# EAGLE design driver3 (EAGLE 9.5.2)
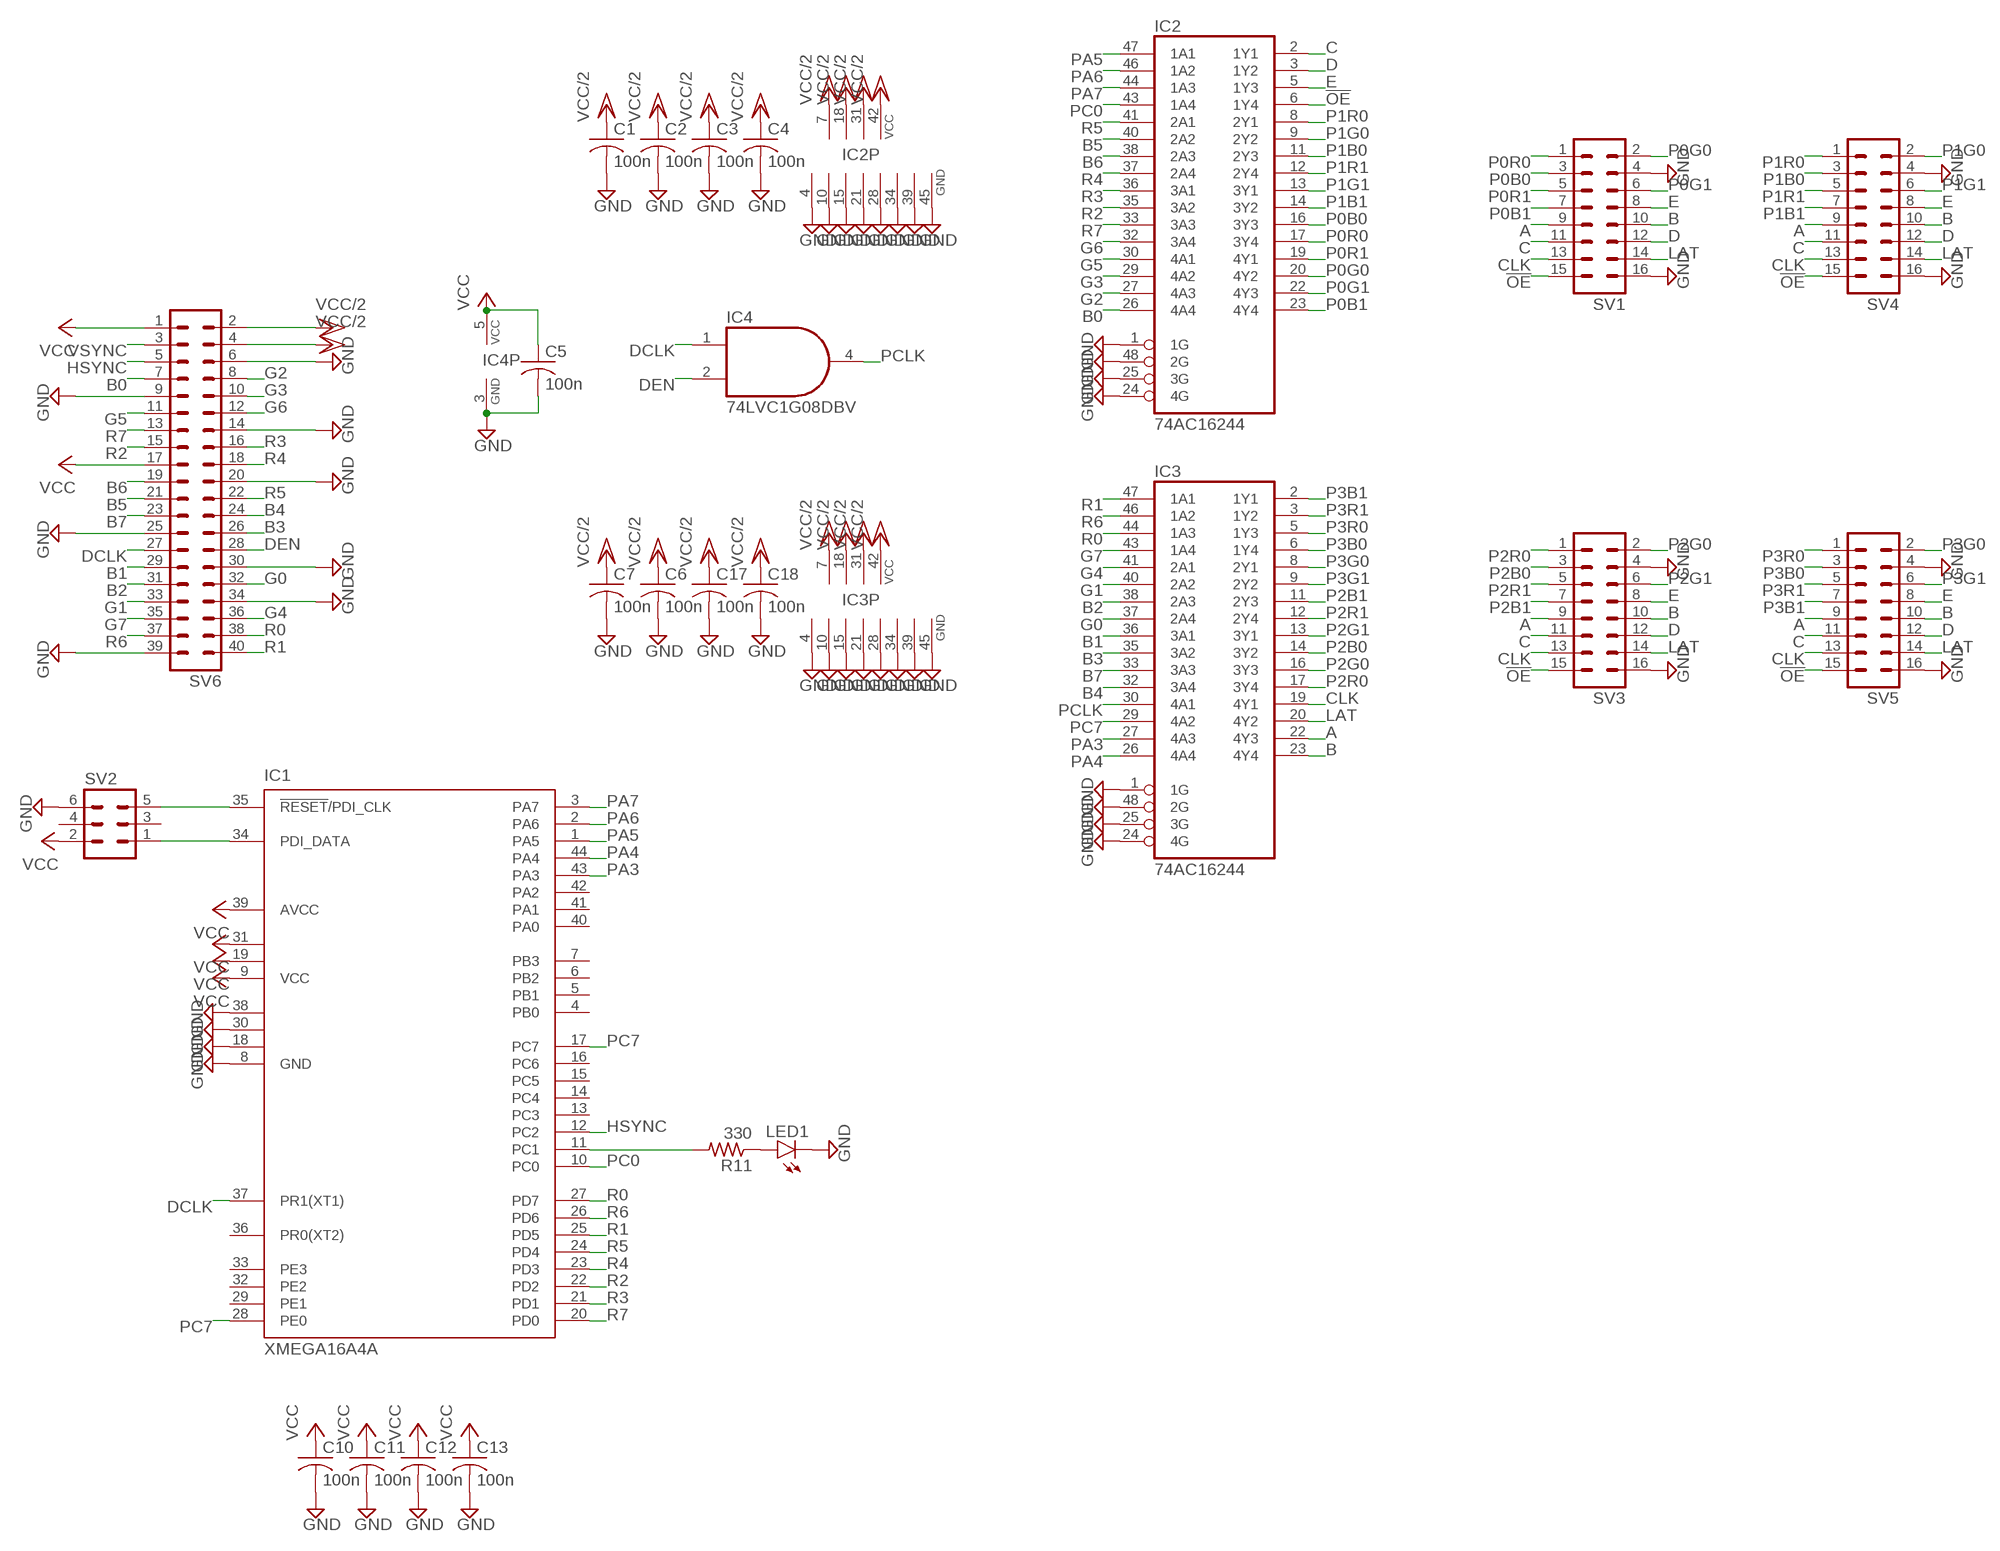
[diagram p0: schematic, sheet 1]

## Parts
C1  100n  C-USC0402  [C0402]
C2  100n  C-USC0402  [C0402]
C3  100n  C-USC0402  [C0402]
C4  100n  C-USC0402  [C0402]
C5  100n  C-USC0402  [C0402]
C6  100n  C-USC0402  [C0402]
C7  100n  C-USC0402  [C0402]
C10  100n  C-USC0402  [C0402]
C11  100n  C-USC0402  [C0402]
C12  100n  C-USC0402  [C0402]
C13  100n  C-USC0402  [C0402]
C17  100n  C-USC0402  [C0402]
C18  100n  C-USC0402  [C0402]
IC1  XMEGA16A4A  [TQFP44]
IC2  74AC16244  [SSOP48DL]
IC3  74AC16244  [SSOP48DL]
IC4  74LVC1G08DBV  [SOT23-5]
LED1  LEDCHIPLED_0805  [CHIPLED_0805]
R11  330  R-US_R0402  [R0402]
SV1  MA08-2  [MA08-2]
SV2  MA03-2  [MA03-2]
SV3  MA08-2  [MA08-2]
SV4  MA08-2  [MA08-2]
SV5  MA08-2  [MA08-2]
SV6  MA20-2  [MA20-2]

## Nets
!OE: IC2.6(1Y4) SV1.15 SV3.15 SV4.15 SV5.15
A: IC3.22(4Y3) SV1.9 SV3.9 SV4.9 SV5.9
B: IC3.23(4Y4) SV1.10 SV3.10 SV4.10 SV5.10
B0: IC2.26(4A4) SV6.7
B1: IC3.36(3A1) SV6.29
B2: IC3.38(2A3) SV6.31
B3: IC3.35(3A2) SV6.26
B4: IC3.32(3A4) SV6.24
B5: IC2.40(2A2) SV6.21
B6: IC2.38(2A3) SV6.19
B7: IC3.33(3A3) SV6.23
C: IC2.2(1Y1) SV1.11 SV3.11 SV4.11 SV5.11
CLK: IC3.19(4Y1) SV1.13 SV3.13 SV4.13 SV5.13
D: IC2.3(1Y2) SV1.12 SV3.12 SV4.12 SV5.12
DCLK: IC1.37(PR1(XT1)) IC4.1(I0) SV6.27
DEN: IC4.2(I1) SV6.28
E: IC2.5(1Y3) SV1.8 SV3.8 SV4.8 SV5.8
G0: IC3.37(2A4) SV6.32
G1: IC3.40(2A2) SV6.33
G2: IC2.27(4A3) SV6.8
G3: IC2.29(4A2) SV6.10
G4: IC3.41(2A1) SV6.36
G5: IC2.30(4A1) SV6.11
G6: IC2.32(3A4) SV6.12
G7: IC3.43(1A4) SV6.35
GND: C1.2 C2.2 C3.2 C4.2 C5.2 C6.2 C7.2 C10.2 C11.2 C12.2 C13.2 C17.2 C18.2 IC1.8(GND) IC1.18(GND1) IC1.30(GND2) IC1.38(GND3) IC2.1(1G) IC2.4(GND) IC2.10(GND) IC2.15(GND) IC2.21(GND) IC2.24(4G) IC2.25(3G) IC2.28(GND) IC2.34(GND) IC2.39(GND) IC2.45(GND) IC2.48(2G) IC3.1(1G) IC3.4(GND) IC3.10(GND) IC3.15(GND) IC3.21(GND) IC3.24(4G) IC3.25(3G) IC3.28(GND) IC3.34(GND) IC3.39(GND) IC3.45(GND) IC3.48(2G) IC4.3(GND) LED1.C SV1.4 SV1.16 SV2.6 SV3.4 SV3.16 SV4.4 SV4.16 SV5.4 SV5.16 SV6.6 SV6.9 SV6.14 SV6.20 SV6.25 SV6.30 SV6.34 SV6.39
HSYNC: IC1.12(PC2) SV6.5
LAT: IC3.20(4Y2) SV1.14 SV3.14 SV4.14 SV5.14
N$1: IC1.11(PC1) R11.2
N$41: IC1.34(PDI_DATA) SV2.1
N$42: IC1.35(!RESET!/PDI_CLK) SV2.5
N$45: LED1.A R11.1
P0B0: IC2.16(3Y3) SV1.3
P0B1: IC2.23(4Y4) SV1.7
P0G0: IC2.20(4Y2) SV1.2
P0G1: IC2.22(4Y3) SV1.6
P0R0: IC2.17(3Y4) SV1.1
P0R1: IC2.19(4Y1) SV1.5
P1B0: IC2.11(2Y3) SV4.3
P1B1: IC2.14(3Y2) SV4.7
P1G0: IC2.9(2Y2) SV4.2
P1G1: IC2.13(3Y1) SV4.6
P1R0: IC2.8(2Y1) SV4.1
P1R1: IC2.12(2Y4) SV4.5
P2B0: IC3.14(3Y2) SV3.3
P2B1: IC3.11(2Y3) SV3.7
P2G0: IC3.16(3Y3) SV3.2
P2G1: IC3.13(3Y1) SV3.6
P2R0: IC3.17(3Y4) SV3.1
P2R1: IC3.12(2Y4) SV3.5
P3B0: IC3.6(1Y4) SV5.3
P3B1: IC3.2(1Y1) SV5.7
P3G0: IC3.8(2Y1) SV5.2
P3G1: IC3.9(2Y2) SV5.6
P3R0: IC3.5(1Y3) SV5.1
P3R1: IC3.3(1Y2) SV5.5
PA3: IC1.43(PA3) IC3.27(4A3)
PA4: IC1.44(PA4) IC3.26(4A4)
PA5: IC1.1(PA5) IC2.47(1A1)
PA6: IC1.2(PA6) IC2.46(1A2)
PA7: IC1.3(PA7) IC2.44(1A3)
PC0: IC1.10(PC0) IC2.43(1A4)
PC7: IC1.17(PC7) IC1.28(PE0) IC3.29(4A2)
PCLK: IC3.30(4A1) IC4.4(O)
R0: IC1.27(PD7) IC3.44(1A3) SV6.38
R1: IC1.25(PD5) IC3.47(1A1) SV6.40
R2: IC1.22(PD2) IC2.35(3A2) SV6.15
R3: IC1.21(PD1) IC2.36(3A1) SV6.16
R4: IC1.23(PD3) IC2.37(2A4) SV6.18
R5: IC1.24(PD4) IC2.41(2A1) SV6.22
R6: IC1.26(PD6) IC3.46(1A2) SV6.37
R7: IC1.20(PD0) IC2.33(3A3) SV6.13
VCC: C5.1 C10.1 C11.1 C12.1 C13.1 IC1.9(VCC) IC1.19(VCC1) IC1.31(VCC2) IC1.39(AVCC) IC4.5(VCC) SV2.2 SV6.1 SV6.17
VCC/2: C1.1 C2.1 C3.1 C4.1 C6.1 C7.1 C17.1 C18.1 IC2.7(VCC) IC2.18(VCC) IC2.31(VCC) IC2.42(VCC) IC3.7(VCC) IC3.18(VCC) IC3.31(VCC) IC3.42(VCC) SV6.2 SV6.4
VSYNC: SV6.3
Unconnected: IC1.4(PB0) IC1.5(PB1) IC1.6(PB2) IC1.7(PB3) IC1.13(PC3) IC1.14(PC4) IC1.15(PC5) IC1.16(PC6) IC1.29(PE1) IC1.32(PE2) IC1.33(PE3) IC1.36(PR0(XT2)) IC1.40(PA0) IC1.41(PA1) IC1.42(PA2) SV2.3 SV2.4

## Library data of the parts
C1-C7 C10-C13 C17 C18 = rcl:C-US: CAPACITOR, American symbol; SPICEPREFIX: C
IC1 = atmel:XMEGA16A4: MICROCONTROLLER Features High-performance, Low-power 8/16-bit AVR XMEGA Microcontroller Non-Volatile Program and Data Memories - 16 KB - 128 KB of In-System Self-Programmable Flash - 4 KB - 8 KB Boot Code Section with Independent Lock Bits - 1 KB - 2 KB EEPROM - 2 KB - 8 KB Internal SRAM Peripheral Features - Four-channel DMA Controller with support for external requests - Eight-channel Event System - Five 16-bit Timer/Counters Three Timer/Counters with 4 Output Compare or Input Capture channels Two Timer/Counters with 2 Output Compare or Input Capture channels High-Resolution Extensions on all Timer/Counters Advanced Waveform Extension on one Timer/Counter - Five USARTs IrDA Extension on one USART - Two Two-Wire Interfaces with dual address match (I2C and SMBus compatible) - Two SPIs (Serial Peripheral Interfaces) peripherals - AES and DES Crypto Engine - 16-bit Real Time Counter with Separate Oscillator - One Twelve-channel, 12-bit, 2 Msps Analog to Digital Converter - One Two-channel, 12-bit, 1 Msps Digital to Analog Converter - Two Analog Comparators with Window compare function - External Interrupts on all General Purpose I/O pins - Programmable Watchdog Timer with Separate On-chip Ultra Low Power Oscillator Special Microcontroller Features - Power-on Reset and Programmable Brown-out Detection - Internal and External Clock Options with PLL - Programmable Multi-level Interrupt Controller - Sleep Modes: Idle, Power-down, Standby, Power-save, Extended Standby - Advanced Programming, Test and Debugging Interfaces PDI (Program and Debug Interface) for programming, test and debugging I/O and Packages - 34 Programmable I/O Lines - 44 - lead TQFP - 44 - pad VQFN/QFN - 49 - ball VFBGA Operating Voltage - 1.6 - 3.6V Speed performance - 0 - 12 MHz @ 1.6 - 3.6V - 0 - 32 MHz @ 2.7 - 3.6V Drawn by Dipl.-Ing. (FH) Robert Siegler Created: 27.05.09; OC_FARNELL: unknown; OC_NEWARK: unknown
IC2 IC3 = 74ac-logic:74AC16244: 16-bit BUFFER/LINE DRIVER, 3-state
IC4 = 74xx-little-us:74*1G08: 2-input AND gate
LED1 = led:LED: LED OSRAM: - CHIPLED LG R971, LG N971, LY N971, LG Q971, LY Q971, LO R971, LY R971 LH N974, LH R974 LS Q976, LO Q976, LY Q976 LO Q996 - Hyper CHIPLED LW Q18S LB Q993, LB Q99A, LB R99A - SideLED LS A670, LO A670, LY A670, LG A670, LP A670 LB A673, LV A673, LT A673, LW A673 LH A674 LY A675 LS A676, LA A676, LO A676, LY A676, LW A676 LS A679, LY A679, LG A679 - Hyper Micro SIDELED® LS Y876, LA Y876, LO Y876, LY Y876 LT Y87S - SmartLED LW L88C, LW L88S LB L89C, LB L89S, LG L890 LS L89K, LO L89K, LY L89K LS L896, LA L896, LO L896, LY L896 - TOPLED LS T670, LO T670, LY T670, LG T670, LP T670 LSG T670, LSP T670, LSY T670, LOP T670, LYG T670 LG T671, LOG T671, LSG T671 LB T673, LV T673, LT T673, LW T673 LH T674 LS T676, LA T676, LO T676, LY T676, LB T676, LH T676, LSB T676, LW T676 LB T67C, LV T67C, LT T67C, LS T67K, LO T67K, LY T67K, LW E67C LS E67B, LA E67B, LO E67B, LY E67B, LB E67C, LV E67C, LT E67C LW T67C LS T679, LY T679, LG T679 LS T770, LO T770, LY T770, LG T770, LP T770 LB T773, LV T773, LT T773, LW T773 LH T774 LS E675, LA E675, LY E675, LS T675 LS T776, LA T776, LO T776, LY T776, LB T776 LHGB T686 LT T68C, LB T68C - Hyper Mini TOPLED® LB M676 - Mini TOPLED Santana® LG M470 LS M47K, LO M47K, LY M47K Source: http://www.osram.convergy.de LUXEON: - LUMILED® LXK2-PW12-R00, LXK2-PW12-S00, LXK2-PW14-U00, LXK2-PW14-V00 LXK2-PM12-R00, LXK2-PM12-S00, LXK2-PM14-U00 LXK2-PE12-Q00, LXK2-PE12-R00, LXK2-PE12-S00, LXK2-PE14-T00, LXK2-PE14-U00 LXK2-PB12-K00, LXK2-PB12-L00, LXK2-PB12-M00, LXK2-PB14-N00, LXK2-PB14-P00, LXK2-PB14-Q00 LXK2-PR12-L00, LXK2-PR12-M00, LXK2-PR14-Q00, LXK2-PR14-R00 LXK2-PD12-Q00, LXK2-PD12-R00, LXK2-PD12-S00 LXK2-PH12-R00, LXK2-PH12-S00 LXK2-PL12-P00, LXK2-PL12-Q00, LXK2-PL12-R00 Source: www.luxeon.com KINGBRIGHT: KA-3528ASYC Source: www.kingbright.com
R11 = rcl:R-US_: RESISTOR, American symbol; SPICEPREFIX: R
SV1 SV3-SV5 = con-lstb:MA08-2: PIN HEADER; OC_FARNELL: unknown; OC_NEWARK: unknown
SV2 = con-lstb:MA03-2: PIN HEADER; OC_FARNELL: unknown; OC_NEWARK: unknown
SV6 = con-lstb:MA20-2: PIN HEADER; OC_FARNELL: unknown; OC_NEWARK: unknown

## Board
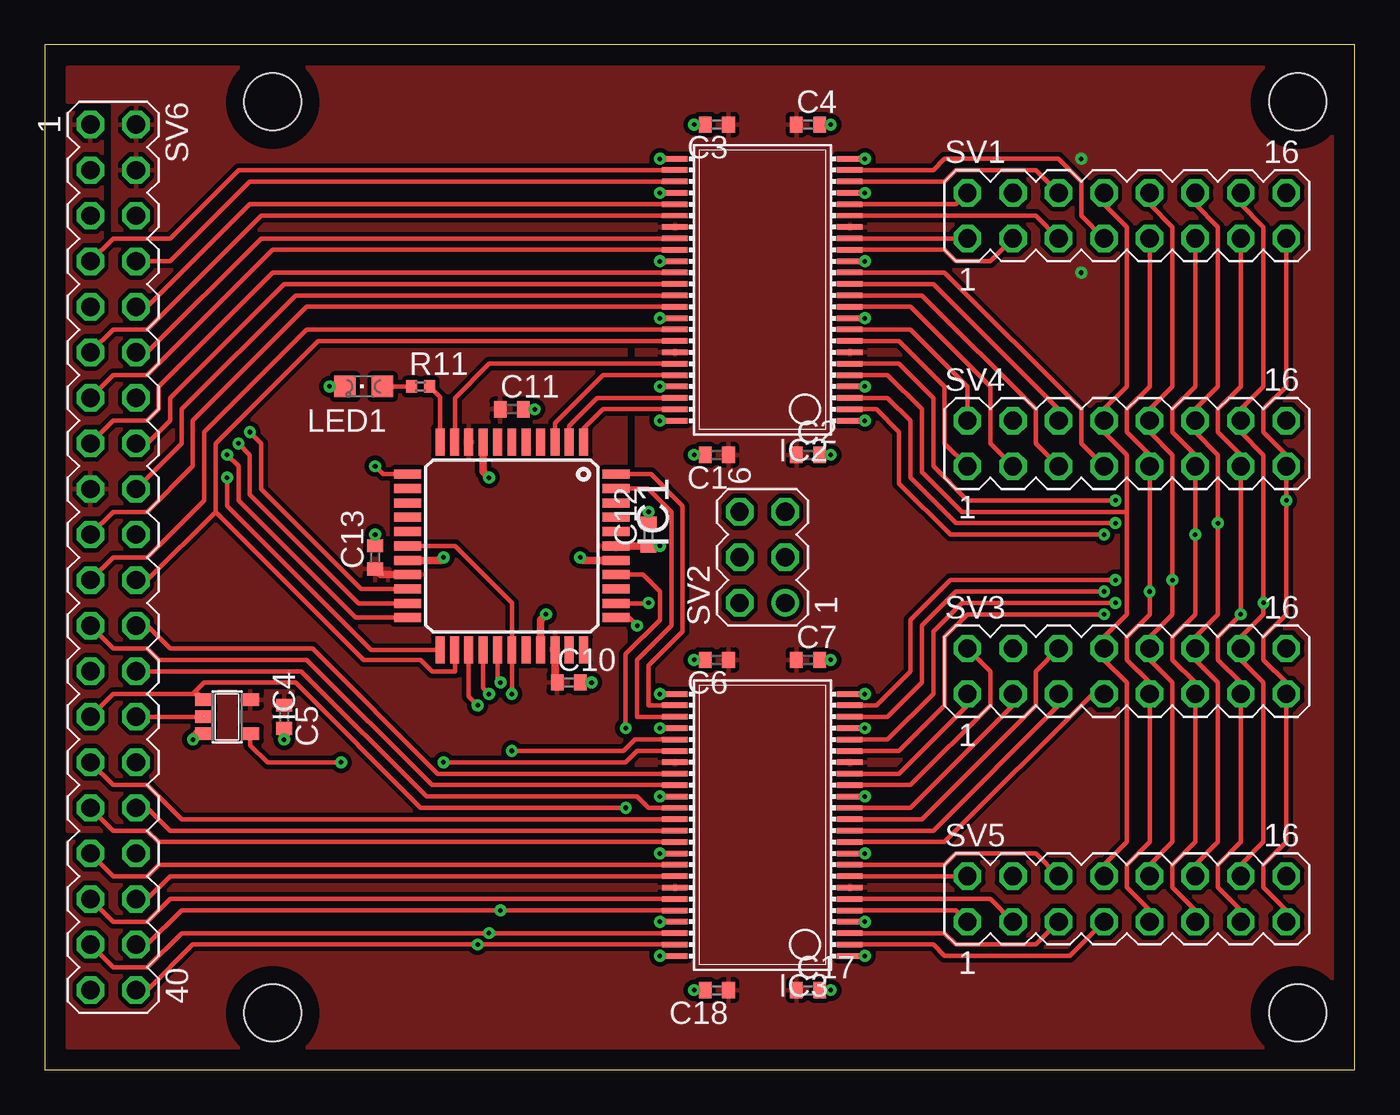
[diagram p1: board, top side]
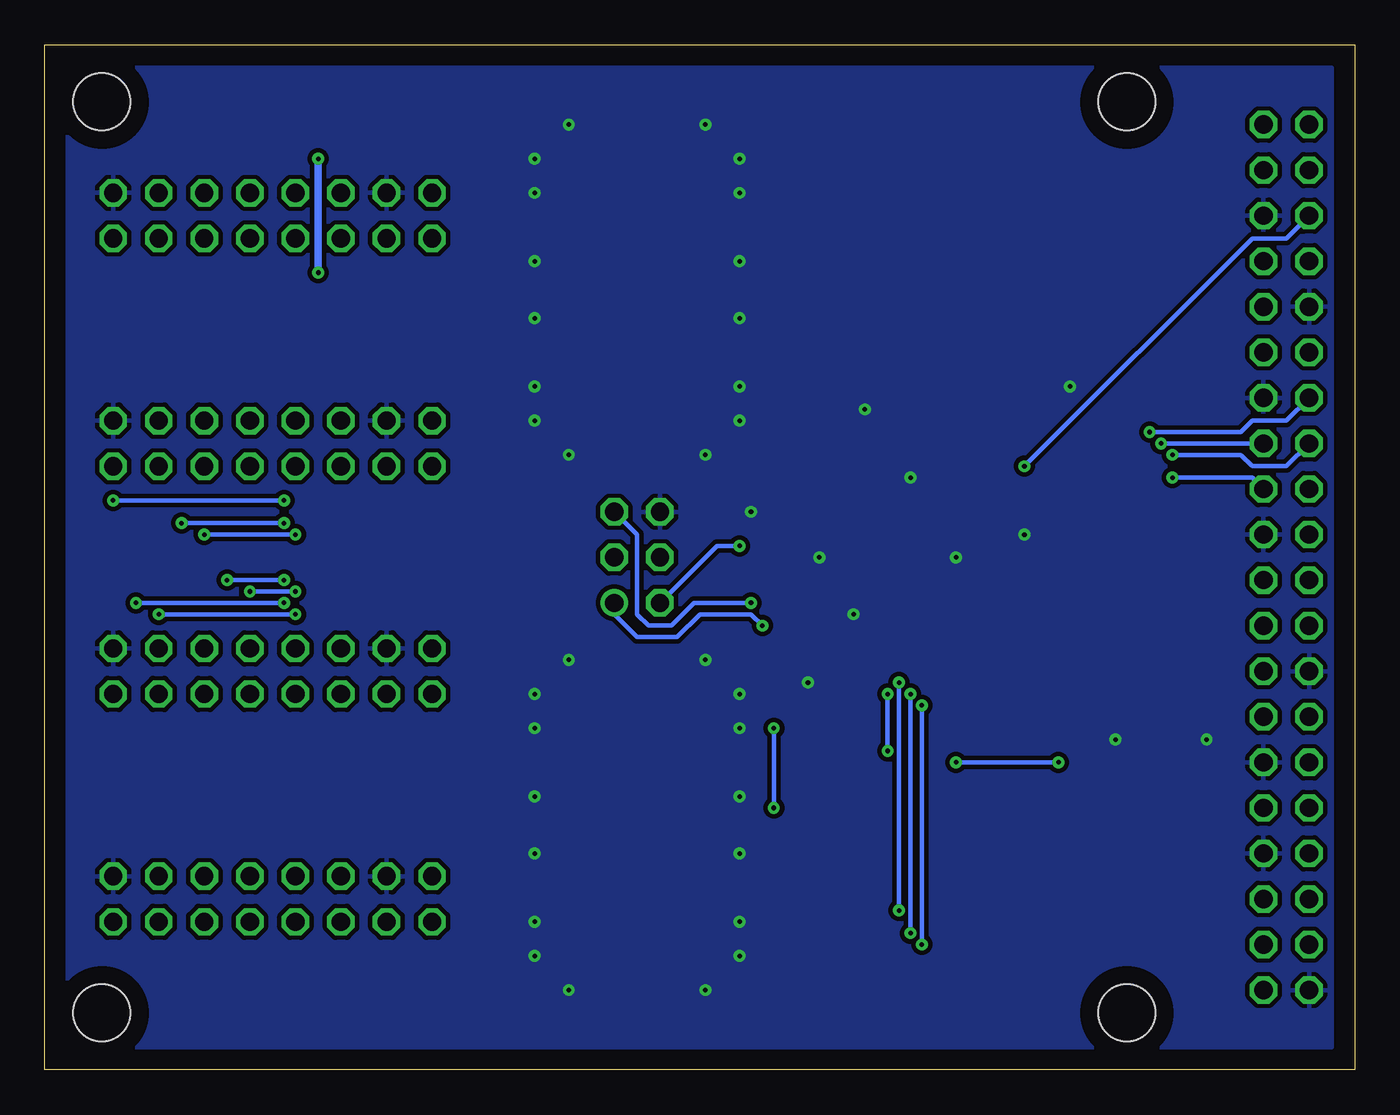
[diagram p2: board, bottom side, seen from below]

Size 73.03 x 57.15 mm. Coordinates in mm from the lower left corner, seen from the top.
Outline: 0,57.15 0,0 73.03,0 73.03,57.15 0,57.15
Copper layers (1*16): Top 0.035mm / dielectric 0.5mm / Bottom 0.035mm
Design rules "33each": minimum track width 5mil, minimum drill 10mil, track to track 5mil, track to pad 5mil, pad to pad 5mil, via to via 5mil, smd to smd 5mil, copper to edge 40mil, drill to drill 8mil, minimum pad ring 10mil, minimum via ring 8mil, stop-mask expansion 4mil, vias tented up to drill 0mil, thermal gap 10mil
Holes 3.17 mm at 12.7,3.17 12.7,53.98 69.85,53.98 69.85,3.17

### Footprints (pad centres in the part's own frame; a part is rotated, then mirrored left to right if it is on the bottom)
C0402 = smd 0.7 x 0.9: 1 -0.65,0; 2 0.65,0
TQFP44 = smd 1.5 x 0.5: 1 -5.8,4; 2 -5.8,3.2; 3 -5.8,2.4; 4 -5.8,1.6; 5 -5.8,0.8; 6 -5.8,0; 7 -5.8,-0.8; 8 -5.8,-1.6; 9 -5.8,-2.4; 10 -5.8,-3.2; 11 -5.8,-4; 23 5.8,-4; 24 5.8,-3.2; 25 5.8,-2.4; 26 5.8,-1.6; 27 5.8,-0.8; 28 5.8,0; 29 5.8,0.8; 30 5.8,1.6; 31 5.8,2.4; 32 5.8,3.2; 33 5.8,4 | smd 0.5 x 1.5: 12 -4,-5.8; 13 -3.2,-5.8; 14 -2.4,-5.8; 15 -1.6,-5.8; 16 -0.8,-5.8; 17 0,-5.8; 18 0.8,-5.8; 19 1.6,-5.8; 20 2.4,-5.8; 21 3.2,-5.8; 22 4,-5.8; 34 4,5.8; 35 3.2,5.8; 36 2.4,5.8; 37 1.6,5.8; 38 0.8,5.8; 39 0,5.8; 40 -0.8,5.8; 41 -1.6,5.8; 42 -2.4,5.8; 43 -3.2,5.8; 44 -4,5.8
SSOP48DL = smd 0.305 x 1.422: 1 -6.985,-4.877; 2 -6.35,-4.877; 3 -5.715,-4.877; 4 -5.08,-4.877; 5 -4.445,-4.877; 6 -3.81,-4.877; 7 -3.175,-4.877; 8 -2.54,-4.877; 9 -1.905,-4.877; 10 -1.27,-4.877; 11 -0.635,-4.877; 12 0,-4.877; 13 0.635,-4.877; 14 1.27,-4.877; 15 1.905,-4.877; 16 2.54,-4.877; 17 3.175,-4.877; 18 3.81,-4.877; 19 4.445,-4.877; 20 5.08,-4.877; 21 5.715,-4.877; 22 6.35,-4.877; 23 6.985,-4.877; 24 7.62,-4.877; 25 7.62,4.877; 26 6.985,4.877; 27 6.35,4.877; 28 5.715,4.877; 29 5.08,4.877; 30 4.445,4.877; 31 3.81,4.877; 32 3.175,4.877; 33 2.54,4.877; 34 1.905,4.877; 35 1.27,4.877; 36 0.635,4.877; 37 0,4.877; 38 -0.635,4.877; 39 -1.27,4.877; 40 -1.905,4.877; 41 -2.54,4.877; 42 -3.175,4.877; 43 -3.81,4.877; 44 -4.445,4.877; 45 -5.08,4.877; 46 -5.715,4.877; 47 -6.35,4.877; 48 -6.985,4.877
SOT23-5 = smd 0.69 x 0.99: 1 -0.95,-1.29; 2 0,-1.29; 3 0.95,-1.29; 4 0.95,1.3; 5 -0.95,1.3
CHIPLED_0805 = smd 1.2 x 1.2: A 0,-1.05; C 0,1.05
R0402 = smd 0.6 x 0.7: 1 -0.5,0; 2 0.5,0
MA08-2 = drill 1.016 octagon: 1 -8.89,-1.27; 2 -8.89,1.27; 3 -6.35,-1.27; 4 -6.35,1.27; 5 -3.81,-1.27; 6 -3.81,1.27; 7 -1.27,-1.27; 8 -1.27,1.27; 9 1.27,-1.27; 10 1.27,1.27; 11 3.81,-1.27; 12 3.81,1.27; 13 6.35,-1.27; 14 6.35,1.27; 15 8.89,-1.27; 16 8.89,1.27
MA03-2 = drill 1.016: 1 -2.54,-1.27 | drill 1.016 octagon: 2 -2.54,1.27; 3 0,-1.27; 4 0,1.27; 5 2.54,-1.27; 6 2.54,1.27
MA20-2 = drill 1.016 octagon: 1 -24.13,-1.27; 2 -24.13,1.27; 3 -21.59,-1.27; 4 -21.59,1.27; 5 -19.05,-1.27; 6 -19.05,1.27; 7 -16.51,-1.27; 8 -16.51,1.27; 9 -13.97,-1.27; 10 -13.97,1.27; 11 -11.43,-1.27; 12 -11.43,1.27; 13 -8.89,-1.27; 14 -8.89,1.27; 15 -6.35,-1.27; 16 -6.35,1.27; 17 -3.81,-1.27; 18 -3.81,1.27; 19 -1.27,-1.27; 20 -1.27,1.27; 21 1.27,-1.27; 22 1.27,1.27; 23 3.81,-1.27; 24 3.81,1.27; 25 6.35,-1.27; 26 6.35,1.27; 27 8.89,-1.27; 28 8.89,1.27; 29 11.43,-1.27; 30 11.43,1.27; 31 13.97,-1.27; 32 13.97,1.27; 33 16.51,-1.27; 34 16.51,1.27; 35 19.05,-1.27; 36 19.05,1.27; 37 21.59,-1.27; 38 21.59,1.27; 39 24.13,-1.27; 40 24.13,1.27

### Placement (x,y rotation side)
C1  37.47,34.29 180 top
C2  42.55,34.29 0 top
C3  37.47,52.7 180 top
C4  42.55,52.7 0 top
C5  13.34,19.68 270 top
C6  37.47,22.86 180 top
C7  42.55,22.86 0 top
C10  29.21,21.59 0 top
C11  26.04,36.83 0 top
C12  33.66,29.84 90 top
C13  18.41,28.57 90 top
C17  42.55,4.45 0 top
C18  37.47,4.45 180 top
IC1  26.04,29.21 270 top
IC2  40.01,43.18 90 top
IC3  40.01,13.34 90 top
IC4  10.16,19.68 270 top
LED1  17.78,38.1 90 top
R11  20.95,38.1 0 top
SV1  60.33,47.62 0 top
SV2  40.01,28.57 90 top
SV3  60.33,22.23 0 top
SV4  60.33,34.92 0 top
SV5  60.33,9.53 0 top
SV6  3.81,28.57 270 top

### Tracks (layer width: path | path; a pad name or v marks a point on that pad's centre or on a via)
!OE  (via drill 0.25)
  Top 0.254: SV5.15 69.22,8.89 67.94,10.16 67.94,11.43 69.22,12.7 SV3.15 69.22,21.59 67.94,22.86 67.94,24.13 69.22,25.4 v69.22,31.75 SV4.15 69.22,34.29 67.94,35.56 67.94,36.83 69.22,38.1 SV1.15 | IC2.6 47.62,39.37 49.53,37.47 49.53,33.66 51.44,31.75 v59.69,31.75
  Bottom 0.254: v59.69,31.75 v69.22,31.75
A  (via drill 0.25)
  Top 0.254: SV5.9 61.59,8.89 60.33,10.16 60.33,11.43 61.59,12.7 SV3.9 61.59,21.59 60.33,22.86 60.33,24.13 61.59,25.4 v61.59,26.67 SV4.9 61.59,34.29 60.33,35.56 60.33,36.83 61.59,38.1 SV1.9 | IC3.22 46.99,19.68 48.9,21.59 48.9,24.77 50.8,26.67 v59.05,26.67
  Bottom 0.254: v59.05,26.67 v61.59,26.67
B  (via drill 0.25)
  Top 0.254: SV5.10 61.59,11.43 62.87,12.7 62.87,21.59 61.59,22.86 SV3.10 61.59,24.13 62.87,25.4 v62.87,27.3 62.87,34.29 61.59,35.56 SV4.10 61.59,36.83 62.87,38.1 62.87,46.99 61.59,48.26 SV1.10 | IC3.23 46.35,20.32 48.26,22.23 48.26,25.08 50.48,27.3 v59.69,27.3
  Bottom 0.254: v59.69,27.3 v62.87,27.3
B0
  Top 0.254: SV6.7 3.81,46.35 6.99,46.35 10.79,50.16 IC2.26
B1
  Top 0.254: SV6.29 3.81,15.88 5.71,15.88 7.62,13.97 IC3.36
B2
  Top 0.254: SV6.31 3.81,13.34 5.71,13.34 6.35,12.7 IC3.38
B3
  Top 0.254: 5.4,22.23 SV6.26 14.29,22.23 21.27,15.24 33.02,15.24 33.66,14.61 IC3.35
B4
  Top 0.254: IC3.32 21.91,16.51 14.92,23.5 6.99,23.5 5.71,24.77 SV6.24
B5
  Top 0.254: SV6.21 3.81,28.57 5.71,28.57 8.89,31.75 8.89,35.56 14.61,41.27 IC2.40
B6
  Top 0.254: IC2.38 14.61,42.55 8.26,36.2 8.26,33.66 5.71,31.11 3.81,31.11 SV6.19
B7
  Top 0.254: IC3.33 21.59,15.88 14.61,22.86 6.35,22.86 5.71,23.5 3.81,23.5 SV6.23
C  (via drill 0.25)
  Top 0.254: SV5.11 64.14,8.89 62.87,10.16 62.87,11.43 64.14,12.7 SV3.11 64.14,21.59 62.87,22.86 62.87,24.13 64.14,25.4 v64.14,29.84 SV4.11 64.14,34.29 62.87,35.56 62.87,36.83 64.14,38.1 SV1.11 | IC2.2 46.35,36.83 47.62,35.56 47.62,32.7 50.48,29.84 v59.05,29.84
  Bottom 0.254: v64.14,29.84 v59.05,29.84
CLK  (via drill 0.25)
  Top 0.254: SV5.13 66.67,8.89 65.41,10.16 65.41,11.43 66.67,12.7 SV3.13 66.67,21.59 65.41,22.86 65.41,24.13 v66.67,25.4 SV4.13 66.67,34.29 65.41,35.56 65.41,36.83 66.67,38.1 SV1.13 | IC3.19 47.62,17.78 50.16,20.32 50.16,24.13 51.44,25.4 v59.05,25.4
  Bottom 0.254: v59.05,25.4 v66.67,25.4
D  (via drill 0.25)
  Top 0.254: SV5.12 64.14,11.43 65.41,12.7 65.41,21.59 64.14,22.86 SV3.12 64.14,24.13 65.41,25.4 v65.41,30.48 65.41,34.29 64.14,35.56 SV4.12 64.14,36.83 65.41,38.1 65.41,46.99 64.14,48.26 SV1.12 | IC2.3 46.99,37.47 48.26,36.2 48.26,33.02 50.8,30.48 v59.69,30.48
  Bottom 0.254: v65.41,30.48 v59.69,30.48
DCLK  (via drill 0.25)
  Top 0.254: SV6.27 3.81,20.95 8.26,20.95 | 8.26,20.95 8.55,20.95 IC4.1 8.89,20.66 | IC1.37 33.35,27.61 34.29,26.67 34.29,25.08 32.38,23.18 v32.38,19.05 | 8.26,20.95 8.89,21.59 13.97,21.59 20.95,14.61 v32.38,14.61
  Bottom 0.254: v32.38,19.05 v32.38,14.61
DEN
  Top 0.254: SV6.28 IC4.2
E
  Top 0.254: SV5.8 59.05,11.43 60.33,12.7 60.33,21.59 59.05,22.86 SV3.8 59.05,24.13 60.33,25.4 60.33,31.11 | 60.33,31.11 60.33,34.29 59.05,35.56 SV4.8 59.05,36.83 60.33,38.1 60.33,46.99 59.05,48.26 SV1.8 | IC2.5 46.99,38.73 48.9,36.83 48.9,33.34 51.12,31.11 60.33,31.11
G0
  Top 0.254: IC3.37 6.99,13.34 5.71,14.61 SV6.32
G1
  Top 0.254: IC3.40 6.35,11.43 5.71,10.79 3.81,10.79 SV6.33
G2
  Top 0.254: SV6.8 6.99,45.09 11.43,49.53 IC2.27
G3
  Top 0.254: SV6.10 5.71,42.55 11.43,48.26 IC2.29
G4
  Top 0.254: SV6.36 5.71,9.53 6.99,10.79 IC3.41
G5
  Top 0.254: SV6.11 3.81,41.27 5.71,41.27 12.06,47.62 IC2.30
G6
  Top 0.254: SV6.12 5.71,40.01 12.06,46.35 IC2.32
G7
  Top 0.254: IC3.43 6.99,9.53 5.71,8.26 3.81,8.26 SV6.35
GND  (via drill 0.25)
  Top 0.254: IC2.1 v45.72,36.2 | IC2.10 v45.72,41.91 | IC2.48 v34.29,36.2 | IC2.39 v34.29,41.91 | IC2.34 v34.29,45.09 | IC2.15 v45.72,45.09 | IC2.21 v45.72,48.9 | IC2.25 v34.29,50.8 | IC2.45 v34.29,38.1 | IC2.4 v45.72,38.1 | IC2.24 v45.72,50.8 | IC2.28 v34.29,48.9 | IC3.25 v34.29,20.95 | IC3.28 v34.29,19.05 | IC3.34 v34.29,15.24 | IC3.39 v34.29,12.06 | IC3.45 v34.29,8.26 | IC3.48 v34.29,6.35 | IC3.1 v45.72,6.35 | IC3.4 v45.72,8.26 | IC3.10 v45.72,12.06 | IC3.15 v45.72,15.24 | IC3.21 v45.72,19.05 | IC3.24 v45.72,20.95
  Top 0.406: C2.2 v43.81,34.29 | C1.2 v36.2,34.29 | C4.2 v43.81,52.7 | C3.2 v36.2,52.7 | C17.2 v43.81,4.45 | C18.2 v36.2,4.45 | C6.2 v36.2,22.86 | C7.2 v43.81,22.86 | C12.2 v33.66,31.11 | C11.2 v27.3,36.83 | IC1.38 30.01,28.41 v29.84,28.57 | IC1.8 24.43,33.35 v24.77,33.02 | IC1.30 27.64,25.09 v27.94,25.4 | IC1.18 22.06,28.41 v22.23,28.57 | LED1.C v15.88,38.1 | C13.2 v18.41,29.84 | C10.2 v30.48,21.59
  Top 0.61: C5.2 v13.34,18.41 | IC4.3 8.57,18.73 v8.26,18.41
  pour Bottom (isolate 0.254): 1.27,55.88 71.75,55.88 71.75,1.27 1.27,1.27
HSYNC  (via drill 0.25)
  Top 0.254: IC1.12 18.86,33.21 v18.41,33.66
  Bottom 0.254: SV6.5 3.81,46.35 5.71,46.35 v18.41,33.66
LAT  (via drill 0.25)
  Top 0.254: SV5.14 66.67,11.43 67.94,12.7 67.94,21.59 66.67,22.86 SV3.14 66.67,24.13 67.94,25.4 v67.94,26.04 67.94,34.29 66.67,35.56 SV4.14 66.67,36.83 67.94,38.1 67.94,46.99 66.67,48.26 SV1.14 | IC3.20 46.99,18.41 49.53,20.95 49.53,24.45 51.12,26.04 v59.69,26.04
  Bottom 0.254: v59.69,26.04 v67.94,26.04
N$1
  Top 0.254: IC1.11 22.04,37.52 R11.2
N$41  (via drill 0.25)
  Top 0.254: v33.01,24.78 v33.02,24.77 32.58,25.21 IC1.34
  Bottom 0.254: SV2.1 41.27,25.4 40.01,24.13 37.78,24.13 36.51,25.4 33.66,25.4 v33.02,24.77
N$42  (via drill 0.25)
  Top 0.254: IC1.35 33.63,26.01 v33.66,26.04
  Bottom 0.254: SV2.5 40.01,29.84 40.01,25.4 39.37,24.77 38.1,24.77 36.83,26.04 v33.66,26.04
N$45
  Top 0.254: R11.1 LED1.A
P0B0
  Top 0.254: IC2.16 50.16,45.72 50.8,45.09 52.7,45.09 SV1.3
P0B1
  Top 0.254: SV1.7 57.78,47.62 57.78,49.53 56.52,50.8 50.16,50.8 49.53,50.16 IC2.23
P0G0
  Top 0.254: IC2.20 50.8,48.26 SV1.2
P0G1
  Top 0.254: SV1.6 55.24,50.16 50.8,50.16 50.16,49.53 IC2.22
P0R0
  Top 0.254: IC2.17 SV1.1
P0R1
  Top 0.254: IC2.19 55.24,47.62 SV1.5
P1B0
  Top 0.254: IC2.11 48.26,42.55 52.7,38.1 52.7,34.92 SV4.3
P1B1
  Top 0.254: SV4.7 57.78,34.92 57.78,36.83 50.16,44.45 IC2.14
P1G0
  Top 0.254: IC2.9 48.26,41.27 51.44,38.1 SV4.2
P1G1
  Top 0.254: SV4.6 56.52,36.83 49.53,43.81 IC2.13
P1R0
  Top 0.254: IC2.8 47.62,40.64 50.16,38.1 50.16,34.92 SV4.1
P1R1
  Top 0.254: IC2.12 48.9,43.18 55.24,36.83 55.24,34.92 SV4.5
P2B0
  Top 0.254: SV3.3 53.98,20.32 48.26,14.61 IC3.14
P2B1
  Top 0.254: IC3.11 50.16,12.7 58.42,20.95 SV3.7
P2G0
  Top 0.254: SV3.2 52.7,22.23 52.7,20.32 48.26,15.88 IC3.16
P2G1
  Top 0.254: SV3.6 55.24,22.23 55.24,20.32 48.9,13.97 IC3.13
P2R0
  Top 0.254: IC3.17 47.62,16.51 51.44,20.32 SV3.1
P2R1
  Top 0.254: IC3.12 49.53,13.34 56.52,20.32 SV3.5
P3B0
  Top 0.254: IC3.6 52.7,9.53 SV5.3
P3B1
  Top 0.254: IC3.2 49.53,6.99 50.16,6.35 57.15,6.35 SV5.7
P3G0
  Top 0.254: IC3.8 SV5.2
P3G1
  Top 0.254: IC3.9 50.16,11.43 50.8,12.06 55.24,12.06 SV5.6
P3R0
  Top 0.254: IC3.5 50.8,8.89 SV5.1
P3R1
  Top 0.254: IC3.3 50.16,7.62 50.8,6.99 55.24,6.99 SV5.5
PA3
  Top 0.254: IC1.43 33.63,32.41 34.92,31.11 34.92,24.77 33.02,22.86 33.02,19.68 IC3.27
PA4
  Top 0.254: IC1.44 33.78,33.21 35.56,31.43 35.56,24.45 33.66,22.54 33.66,20.32 IC3.26
PA5
  Top 0.254: IC1.1 30.04,35.75 31.11,36.83 IC2.47
PA6
  Top 0.254: IC1.2 29.23,35.9 30.8,37.47 IC2.46
PA7
  Top 0.254: IC1.3 28.43,36.05 31.11,38.73 IC2.44
PC0
  Top 0.254: IC1.10 22.86,35.03 22.86,37.47 24.77,39.37 IC2.43
PC7  (via drill 0.25)
  Top 0.254: IC3.29 32.91,18.41 32.27,17.78 v26.04,17.78 | IC1.17 22.86,29.21 26.04,26.04 IC1.28 v26.04,20.95
  Bottom 0.254: v26.04,20.95 v26.04,17.78
PCLK  (via drill 0.25)
  Top 0.254: IC3.30 33.02,17.78 32.38,17.14 v22.23,17.14 | v16.51,17.14 12.41,17.14 11.46,18.1 IC4.4
  Bottom 0.254: v22.23,17.14 v16.51,17.14
R0  (via drill 0.25)
  Top 0.254: SV6.38 5.71,6.99 7.62,8.89 v25.4,8.89 IC3.44 | IC1.27 25.23,21.75 v25.4,21.59
  Bottom 0.254: v25.4,21.59 v25.4,8.89
R1  (via drill 0.25)
  Top 0.254: SV6.40 5.71,4.45 8.26,6.99 v24.13,6.99 IC3.47 | IC1.25 23.64,20.82 v24.13,20.32
  Bottom 0.254: v24.13,20.32 v24.13,6.99
R2  (via drill 0.25)
  Top 0.254: SV6.15 3.81,36.2 5.71,36.2 6.35,36.83 6.35,38.1 12.7,44.45 IC2.35 | IC1.22 17.34,25.21 10.79,31.75 10.79,33.66 v10.16,34.29
  Bottom 0.254: v10.16,34.29 6.35,34.29 5.71,33.66 3.81,33.66 SV6.15
R3  (via drill 0.25)
  Top 0.254: SV6.16 5.71,34.92 6.99,36.2 6.99,37.47 13.34,43.81 IC2.36 | 20.26,26.04 IC1.21 17.49,26.01 11.43,32.07 11.43,34.29 v10.79,34.92
  Bottom 0.254: v10.79,34.92 SV6.16
R4  (via drill 0.25)
  Top 0.254: SV6.18 7.62,34.92 7.62,36.83 13.97,43.18 IC2.37 | IC1.23 18.18,23.41 10.16,31.43 v10.16,33.02
  Bottom 0.254: v10.16,33.02 5.71,33.02 SV6.18
R5
  Top 0.254: IC2.41 15.24,40.64 9.53,34.92 9.53,31.11 | 9.53,31.11 5.71,27.3 SV6.22 | IC1.24 22.86,23.39 22.86,22.23 21.59,22.23 20.95,22.86 17.78,22.86 9.53,31.11
R6  (via drill 0.25)
  Top 0.254: IC3.46 v24.77,7.62 7.62,7.62 5.71,5.71 3.81,5.71 SV6.37 | IC1.26 24.43,21.29 v24.77,20.95
  Bottom 0.254: v24.77,20.95 v24.77,7.62
R7  (via drill 0.25)
  Top 0.254: SV6.13 3.81,38.73 5.71,38.73 12.7,45.72 IC2.33 | IC1.20 17.64,26.81 12.06,32.38 12.06,34.92 v11.43,35.56
  Bottom 0.254: SV6.13 3.81,36.2 5.71,36.2 6.35,35.56 v11.43,35.56
VCC  (via drill 0.25)
  Top 0.254: C12.1 34.27,29.2 v34.29,29.21 | C13.1 18.1,27.93
  Top 0.406: IC1.39 33.64,29.21 C12.1 | IC1.19 18.73,27.61 C13.1 | IC1.31 28.43,21.71 C10.1
  Bottom 0.254: v34.29,29.21 35.56,29.21 SV2.2
  pour Top (isolate 0.254): 1.27,13.34 1.27,53.34 3.17,53.34 3.17,45.72 32.38,45.72 32.38,13.34
VCC/2  (via drill 0.25)
  Bottom 0.406: v57.78,50.8 v57.78,44.45
  pour Top (isolate 0.254): 1.27,55.88 1.27,53.98 3.81,53.98 3.81,46.35 33.02,46.35 33.02,12.7 1.27,12.7 1.27,1.27 71.75,1.27 71.75,55.88